# Altium schematic sheet Mini.SchDoc
size Letter; CompanyName: Ploopy Corporation; Organization: Ploopy Corporation; Address1: 137-1140 Burnhamthorpe Road W; Address2: Mississauga; Address3: Ontario; Address4: Canada L5C 0A3; DocumentNumber: 1; Revision: R1.002; SheetNumber: 1; SheetTotal: 8
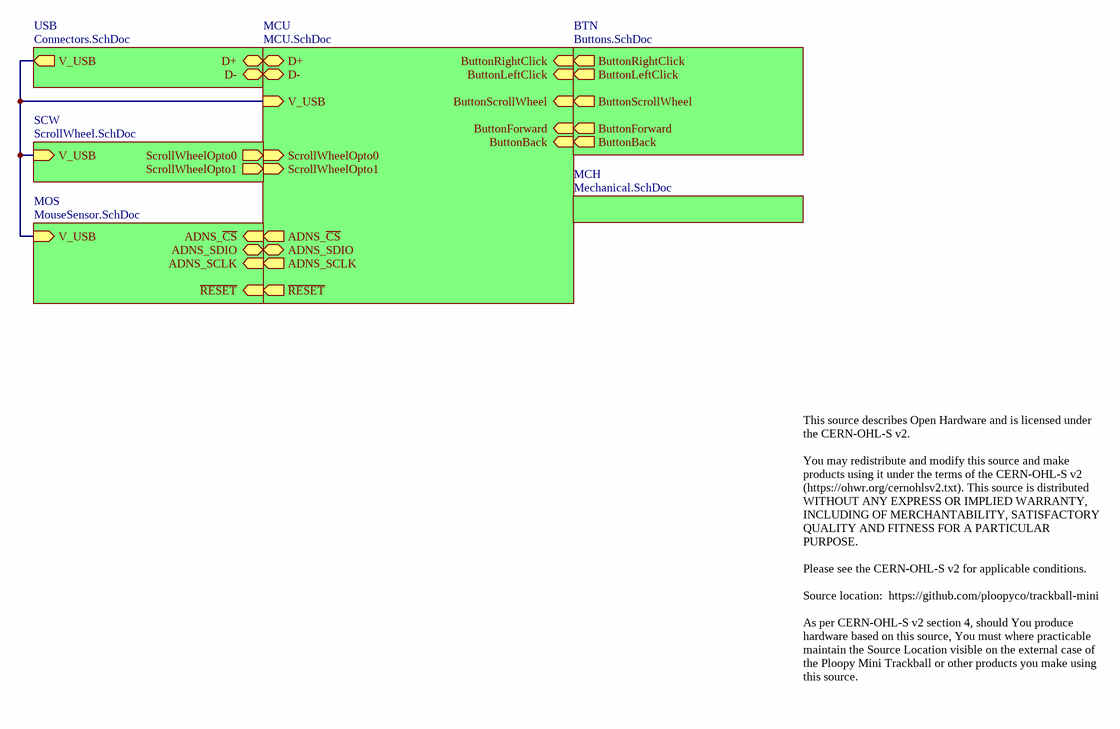
[diagram p0: Mini.SchDoc]

## Sub-sheets
BTN = Buttons.SchDoc: ButtonRightClick (out), ButtonLeftClick (out), ButtonScrollWheel (out), ButtonForward (out), ButtonBack (out)
MCH = Mechanical.SchDoc: no entries
MCU = MCU.SchDoc: D+ (bidir), D- (bidir), ButtonRightClick (in), ButtonLeftClick (in), ButtonScrollWheel (in), V_USB (in), ButtonForward (in), ButtonBack (in), ScrollWheelOpto1 (in), ScrollWheelOpto0 (in), ~{RESET} (out), ADNS_SDIO (bidir), ADNS_~{CS} (out), ADNS_SCLK (out)
MOS = MouseSensor.SchDoc: ~{RESET} (in), V_USB (in), ADNS_~{CS} (in), ADNS_SDIO (bidir), ADNS_SCLK (in)
SCW = ScrollWheel.SchDoc: ScrollWheelOpto1 (out), ScrollWheelOpto0 (out), V_USB (in)
USB = Connectors.SchDoc: D+ (bidir), V_USB (out), D- (bidir)

## Nets
(unnamed): sheet USB/D+, sheet MCU/D+
(unnamed): sheet USB/V_USB, sheet MCU/V_USB, sheet SCW/V_USB, sheet MOS/V_USB
(unnamed): sheet USB/D-, sheet MCU/D-
(unnamed): sheet MCU/ButtonRightClick, sheet BTN/ButtonRightClick
(unnamed): sheet MCU/ButtonLeftClick, sheet BTN/ButtonLeftClick
(unnamed): sheet MCU/ButtonScrollWheel, sheet BTN/ButtonScrollWheel
(unnamed): sheet MCU/ButtonForward, sheet BTN/ButtonForward
(unnamed): sheet MCU/ButtonBack, sheet BTN/ButtonBack
(unnamed): sheet MCU/ScrollWheelOpto1, sheet SCW/ScrollWheelOpto1
(unnamed): sheet MCU/ScrollWheelOpto0, sheet SCW/ScrollWheelOpto0
(unnamed): sheet MCU/~{RESET}, sheet MOS/~{RESET}
(unnamed): sheet MCU/ADNS_SDIO, sheet MOS/ADNS_SDIO
(unnamed): sheet MCU/ADNS_~{CS}, sheet MOS/ADNS_~{CS}
(unnamed): sheet MCU/ADNS_SCLK, sheet MOS/ADNS_SCLK

## Notes on the sheet
- This source describes Open Hardware and is licensed under the CERN-OHL-S v2.
  You may redistribute and modify this source and make products using it under the terms of the CERN-OHL-S v2 (https://ohwr.org/cernohlsv2.txt). This source is distributed WITHOUT ANY EXPRESS OR IMPLIED WARRANTY, INCLUDING OF MERCHANTABILITY, SATISFACTORY QUALITY AND FITNESS FOR A PARTICULAR PURPOSE.
  Please see the CERN-OHL-S v2 for applicable conditions.
  Source location:  https://github.com/ploopyco/trackball-mini
  As per CERN-OHL-S v2 section 4, should You produce hardware based on this source, You must where practicable maintain the Source Location visible on the external case of the Ploopy Mini Trackball or other products you make using this source.
- Copyright Ploopy Corporation 2021
- Licensed under the CERN-OHL-S v2
- http://ohwr.org/cernohl
- Title:
- PCB:
- Version:
- Ploopy Corporation
- Mississauga ON L5C 0A3
- 137-1140 Burnhamthorpe Road W
- Date:
- Time:
- Sheet
- of
- Canada